# EAGLE design Podkładka.pod.kubek.2_Bartosz.Kępa (EAGLE 9.7.0)
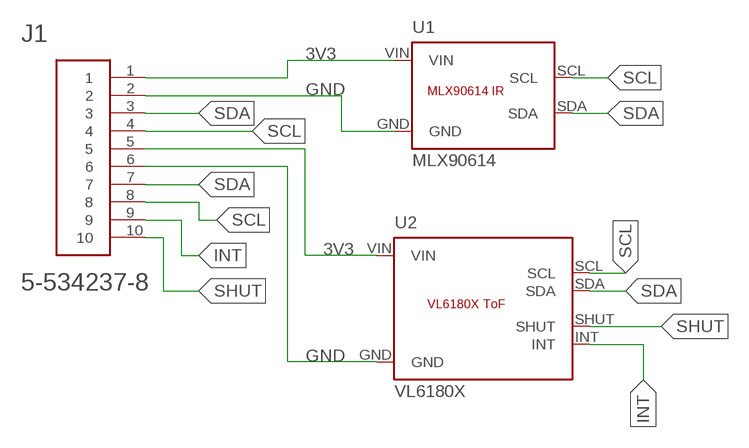
[diagram p0: schematic, sheet 1]

## Parts
J1  5-534237-8  [5-534237-8]
U1  MLX90614  [MLX90614_MODULE]
U2  VL6180X  [VL6180X_MODULE]

## Nets
3V3: J1.1 J1.5 U1.VIN U2.VIN
GND: J1.2 J1.6 U1.GND U2.GND
INT: J1.9 U2.INT
SCL: J1.4 J1.8 U1.SCL U2.SCL
SDA: J1.3 J1.7 U1.SDA U2.SDA
SHUT: J1.10 U2.SHUT

## Library data of the parts
J1 = Connectors:5-534237-8: CONN RCPT 10POS 0.1 GOLD PCB Manufacturer's datasheet <https://www.te.com/commerce/DocumentDelivery/DDEController?Action=srchrtrv&DocNm=534237&DocType=Customer+Drawing&DocLang=English>; CREATED_BY: PCBLayout.com; DIGIKEY_PART_NUMBER: A32910-ND; MANUFACTURER: TE Connectivity AMP Connectors; MPN: 5-534237-8
U1 = eagle_lib_sensors:MLX90614: MLX90614 IR Temperature Sensor Range: -40 to +125°C Accuracy: ±0.5°C Interface: I2C
U2 = eagle_lib_sensors:VL6180X: VL6180X ToF Distance Sensor Range: 5-200mm Accuracy: ±3mm Interface: I2C

## Board
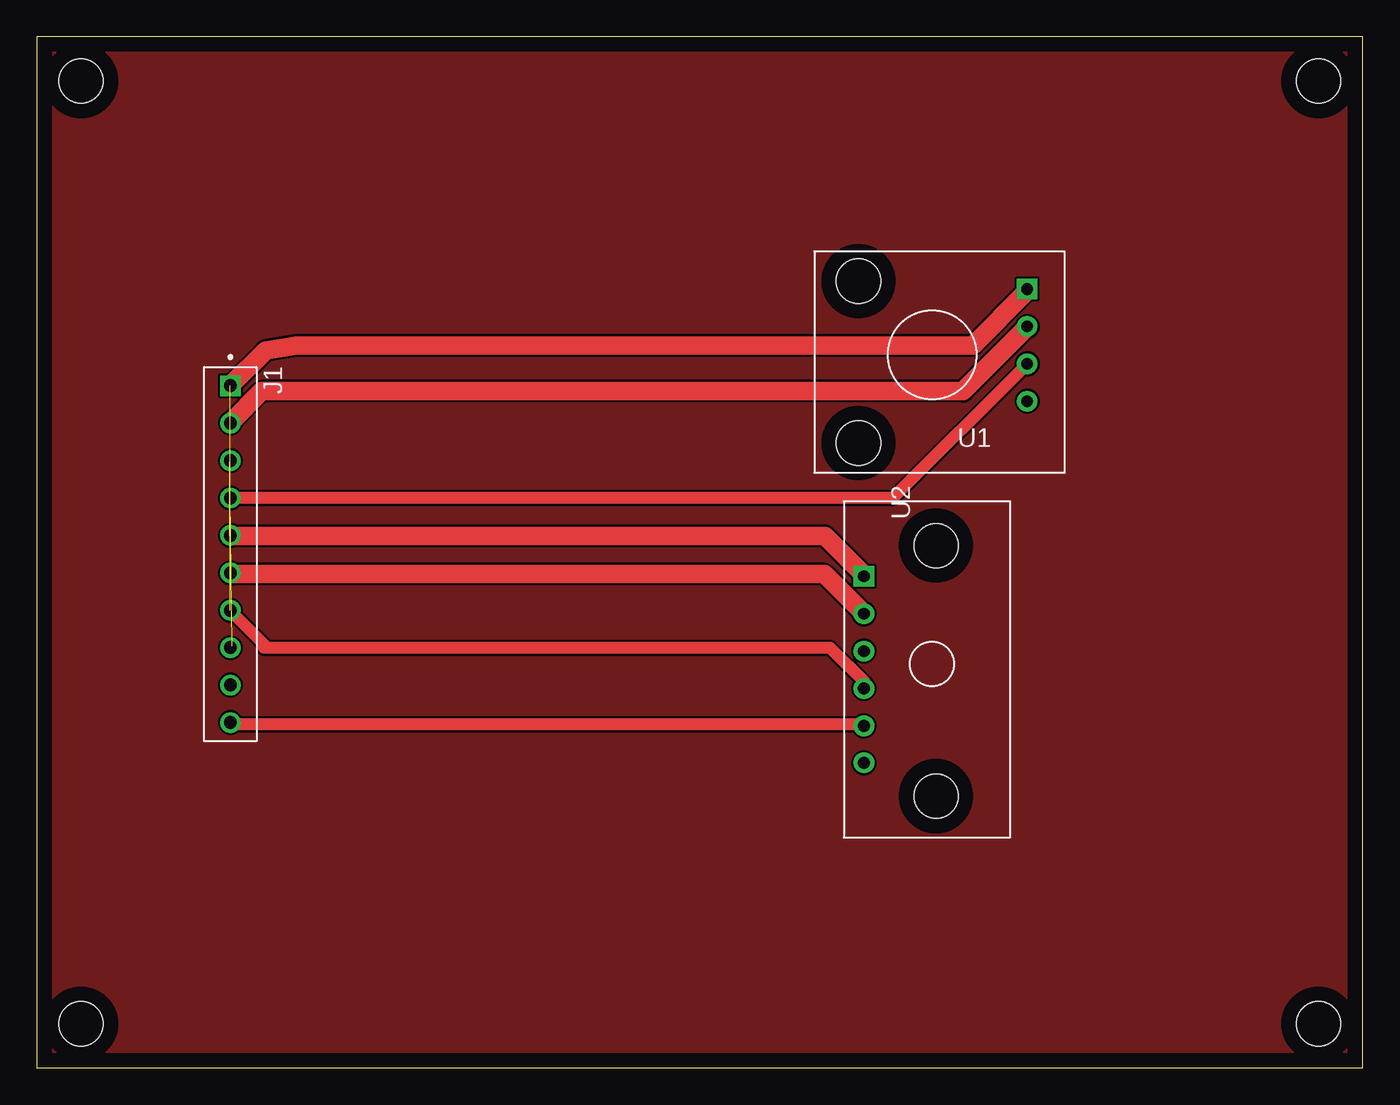
[diagram p1: board, top side]
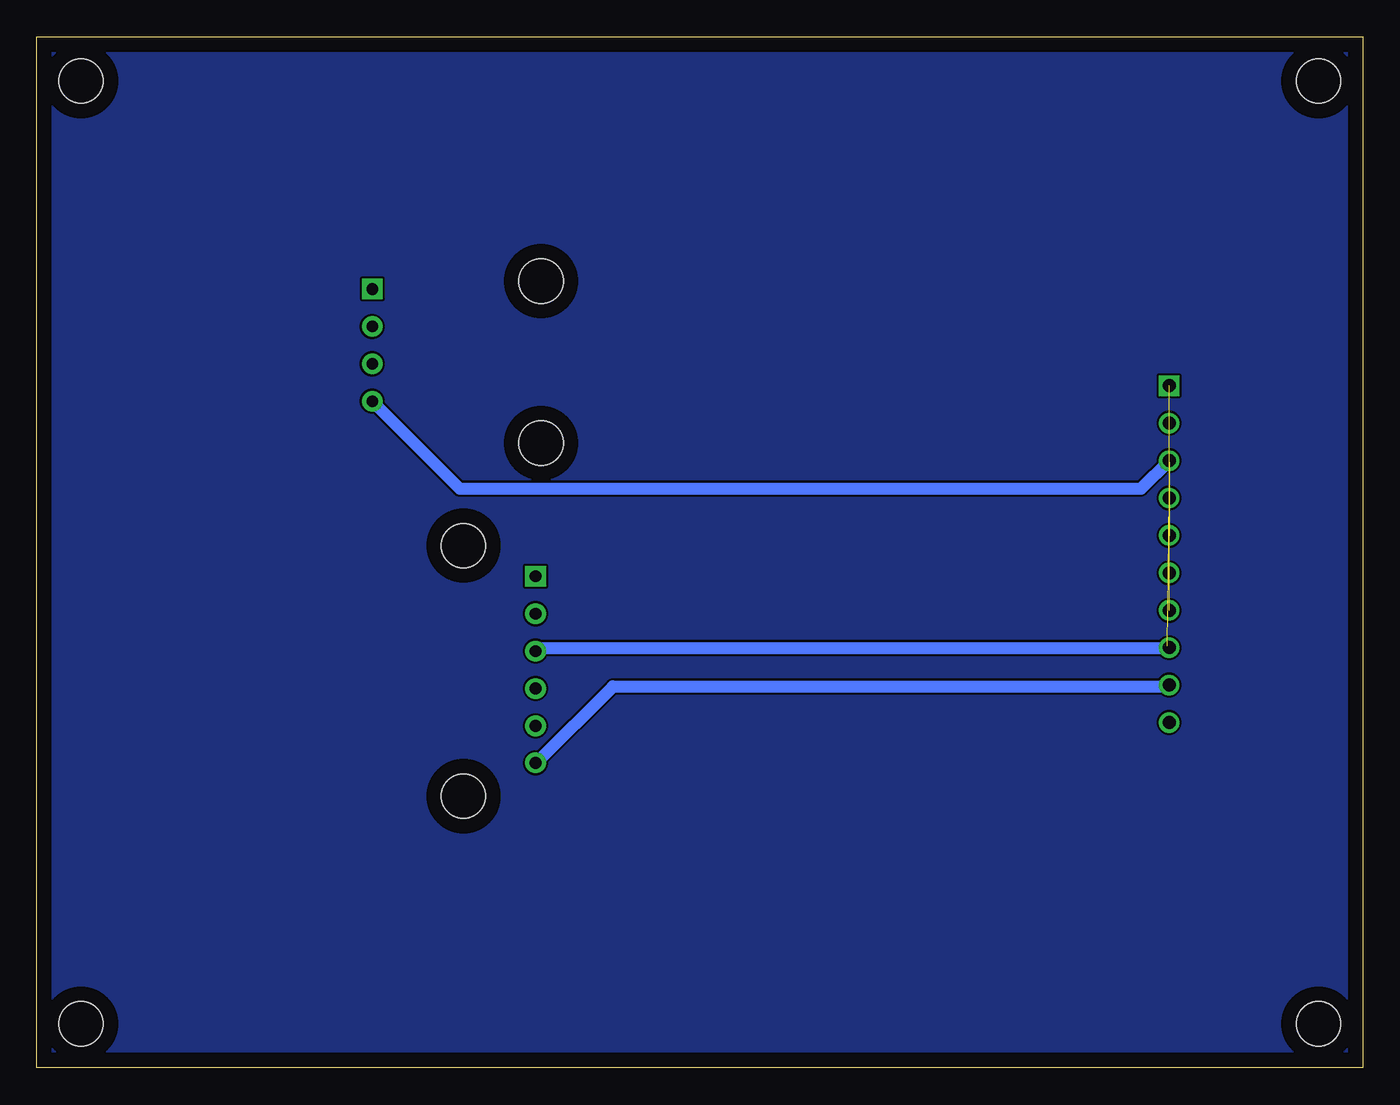
[diagram p2: board, bottom side, seen from below]

Size 90 x 70 mm. Coordinates in mm from the lower left corner, seen from the top.
Outline: 0,0 90,0 90,70 0,70 0,0
Copper layers (1*16): Top 0.035mm / dielectric 1.5mm / Bottom 0.035mm
Design rules "Fusion Electronics Design Rules": minimum track width 6mil, minimum drill 0.35mm, track to track 6mil, track to pad 6mil, pad to pad 6mil, via to via 6mil, smd to smd 6mil, copper to edge 40mil, drill to drill 6mil, minimum pad ring 10mil, minimum via ring 8mil, stop-mask expansion 4mil, vias tented up to drill 9999mil, thermal gap 10mil
Holes 3 mm at 3,3 3,67 87,67 87,3

### Footprints (pad centres in the part's own frame; a part is rotated, then mirrored left to right if it is on the bottom)
5-534237-8 = drill 0.88 square: 1 -11.43,0 | drill 0.88: 2 -8.89,0; 3 -6.35,0; 4 -3.81,0; 5 -1.27,0; 6 1.27,0; 7 3.81,0; 8 6.35,0; 9 8.89,0; 10 11.43,0
MLX90614_MODULE = drill 0.8 pad 1.4: GND 2.54,5.08; SCL 2.54,7.62; SDA 2.54,10.16 | drill 0.8 pad 1.4 square: VIN 2.54,2.54 | hole 3: 14,2; 14,13
VL6180X_MODULE = drill 0.8 pad 1.4: GND 7.62,0.1; INT 17.74,0.1; SCL 10.16,0.1; SDA 12.7,0.1; SHUT 15.24,0.1 | drill 0.8 pad 1.4 square: VIN 5.08,0.1 | hole 3: 3,5; 20,5

### Placement (x,y rotation side)
J1  13.14,34.88 270 top
U1  69.77,55.42 180 top
U2  56.04,38.46 270 top

### Tracks (layer width: path | path; a pad name or v marks a point on that pad's centre or on a via)
3V3  (1 unrouted)
  Top 0.152: 67.21,52.73 U1.VIN | 13.26,36.12 J1.5
  Top 1.27: 67.21,52.73 63.52,49.05 17.61,49.05 15.54,48.7 J1.1 | 13.26,36.12 53.49,36.12 56.08,33.53 U2.VIN
GND  (1 unrouted)
  Top 0.152: 67.21,50.29 U1.GND
  Top 1.27: 67.21,50.29 62.87,45.95 15.28,45.95 J1.2 | J1.6 13.26,33.53 53.45,33.53 U2.GND
INT
  Bottom 0.152: 13.26,25.91 J1.9
  Bottom 0.813: 13.26,25.91 50.9,25.91 56.08,20.73 U2.INT
N$1
  pour Top: 0.08,0.08 89.92,0.08 89.92,69.92 0.08,69.92
N$2
  pour Bottom: 0.08,0.08 89.92,0.08 89.92,69.92 0.08,69.92
SCL  (1 unrouted)
  Top 0.813: U1.SCL 58.12,38.69 J1.4
  Bottom 0.152: 13.26,28.65 J1.8 13.26,28.5 | 55.93,28.5 56.08,28.35 U2.SCL
  Bottom 0.813: 55.93,28.5 13.26,28.5
SDA  (1 unrouted)
  Top 0.152: 13.11,31.09 J1.7 | 13.11,41.15 J1.3
  Top 0.813: U2.SDA 56.24,25.91 56.24,26.14 53.85,28.52 15.67,28.52 | 15.67,28.52 15.42,28.52 | 15.67,28.52 13.11,31.09
  Bottom 0.813: U1.SDA 61.29,39.32 15.05,39.32 J1.3
SHUT
  Top 0.152: 56.08,23.32 U2.SHUT
  Top 0.813: 56.08,23.32 13.26,23.32 J1.10